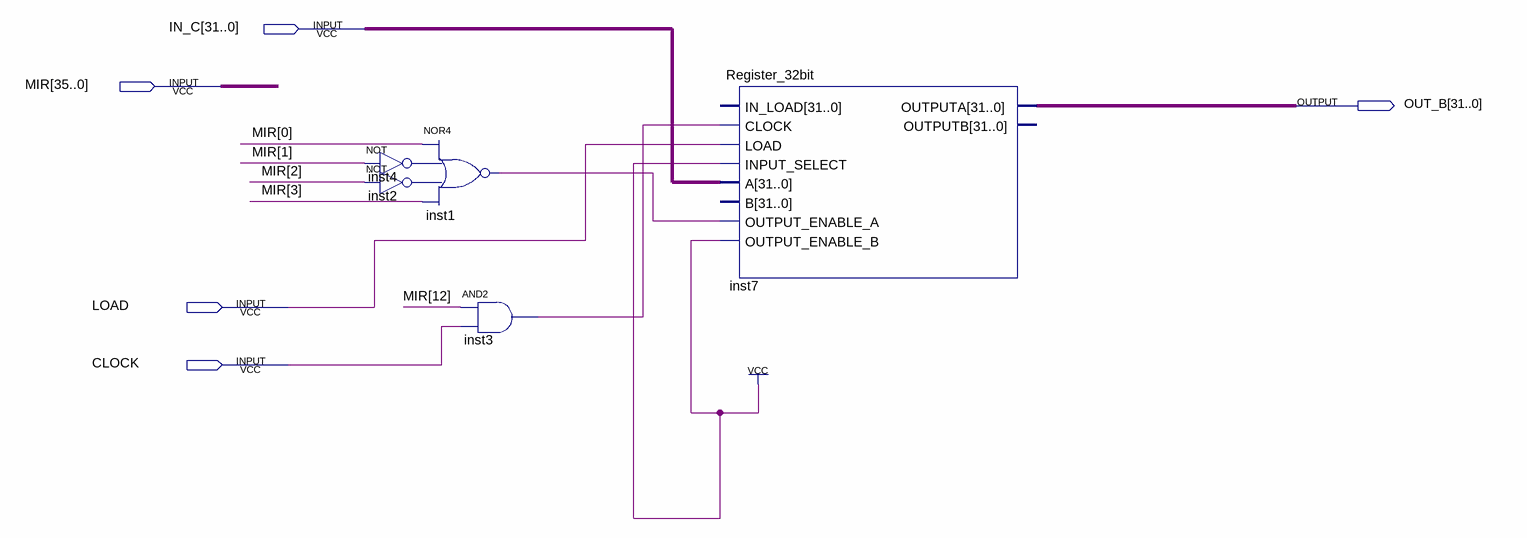
[diagram p0: schematic sheet]
// Quartus schematic CPP.bdf as structural Verilog: 5 symbols, 5 pins
module CPP (
  input  [31:0] IN_C,
  input  [35:0] MIR,
  input  LOAD,
  input  CLOCK,
  output [31:0] OUT_B
);

  wire inst1_out, inst2_out, inst3_out, inst4_out;

  not inst4 (inst4_out, MIR[1]);
  not inst2 (inst2_out, MIR[2]);
  nor inst1 (inst1_out, MIR[0], inst4_out, inst2_out, MIR[3]);
  and inst3 (inst3_out, MIR[12], CLOCK);
  Register_32bit inst7 (
    .CLOCK(inst3_out), .LOAD(LOAD), .INPUT_SELECT(1'b1), .A(IN_C), .OUTPUT_ENABLE_A(inst1_out),
    .OUTPUT_ENABLE_B(1'b1), .OUTPUTA(OUT_B));  // open: IN_LOAD, B, OUTPUTB
endmodule
